# Altium project openadsb_rev_a.PrjPcb
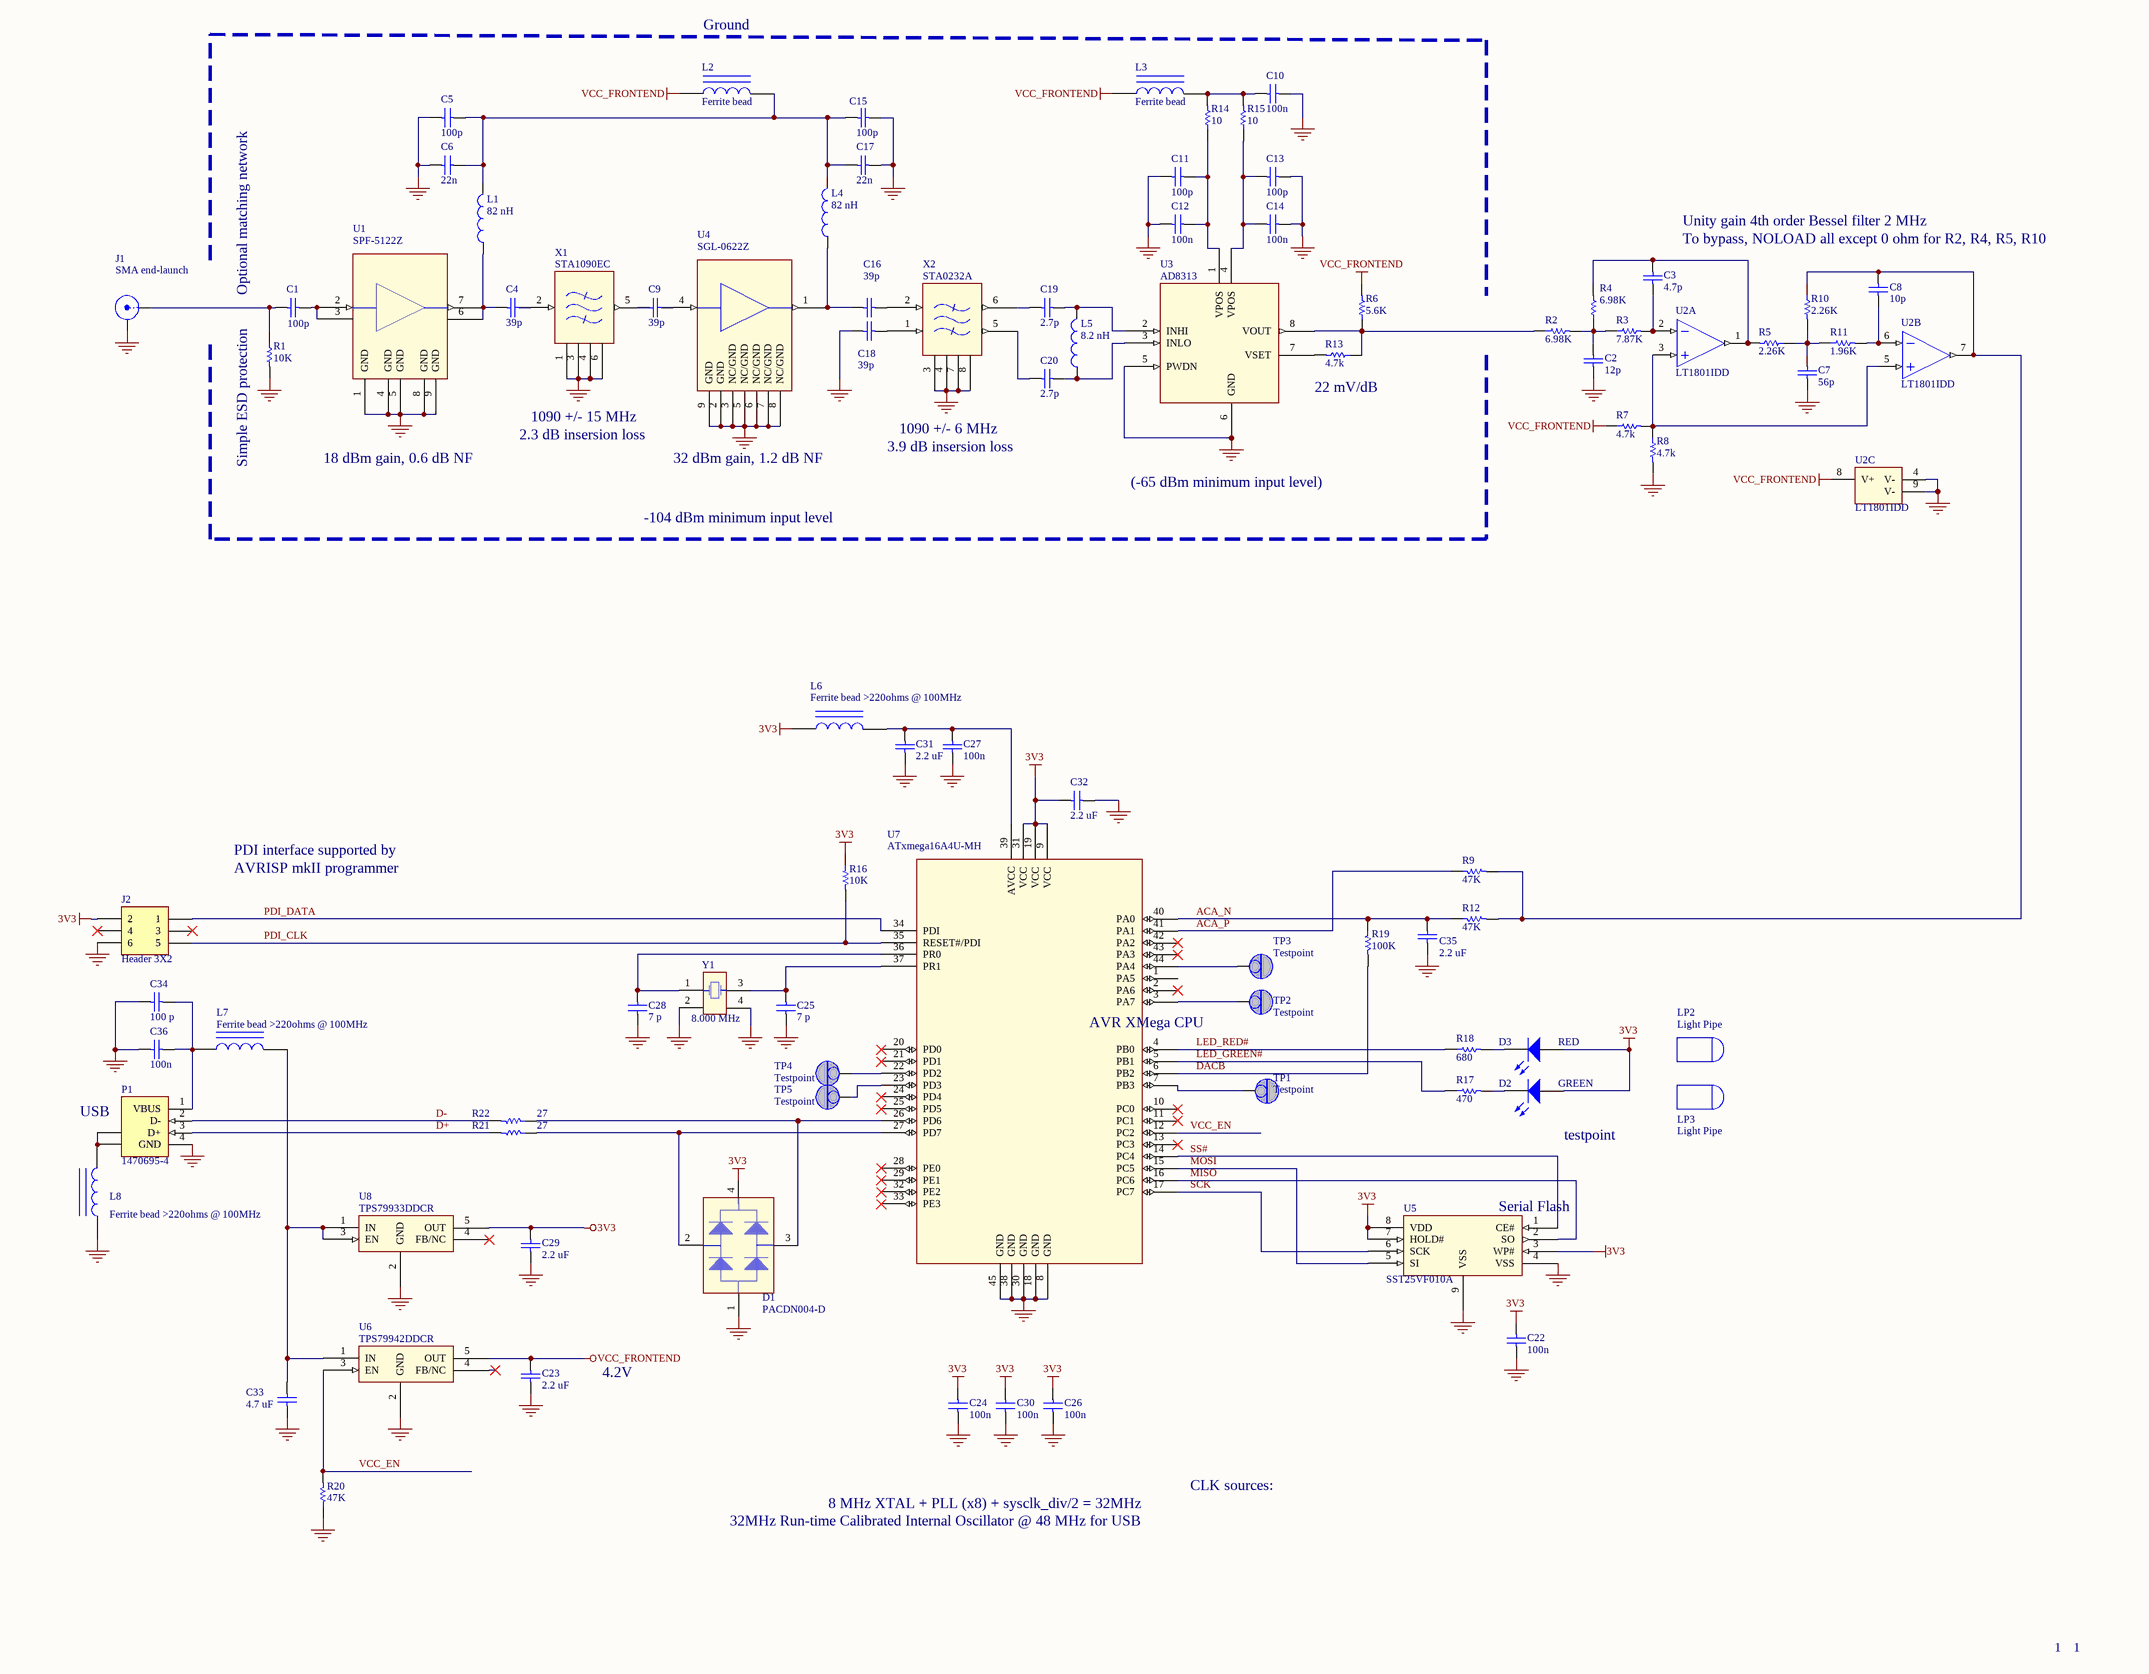
[diagram p0: openadsb_rev_a.SchDoc]
1 sheet, 89 parts. Net scope: global (net labels, ports and power ports of the same name join across sheets).
Board file: openadsb_rev_a.PcbDoc

## Sheet openadsb_rev_a.SchDoc: OpenADSB Receiver and Decoder
size C; Author: B. Kuschak; CompanyName: www.openadsb.com; DrawnBy: B Kuschak; Address1: Sunnyvale, CA USA; Revision: A; SheetNumber: 1; SheetTotal: 1; PageSize: B; Subtitle: ADS-B and Mode A/C on 1090 MHz

### Parts
C1  100p  [0402]
C2  12p  [0402]
C3  4.7p  [0402]
C4  39p  [0402]
C5  100p  [0402]
C6  22n  [0402]
C7  56p  [0402]
C8  10p  [0402]
C9  39p  [0402]
C10  100n  [0402]
C11  100p  [0402]
C12  100n  [0402]
C13  100p  [0402]
C14  100n  [0402]
C15  100p  [0402]
C16  39p  [0402]
C17  22n  [0402]
C18  39p  [0402]
C19  2.7p  [0402]
C20  2.7p  [0402]
C22  100n  [0402]
C23  2.2 uF  [1608[0603]]
C24  100n  [0402]
C25  7 p  [0402]
C26  100n  [0402]
C27  100n  [0402]
C28  7 p  [0402]
C29  2.2 uF  [1608[0603]]
C30  100n  [0402]
C31  2.2 uF  [1608[0603]]
C32  2.2 uF  [1608[0603]]
C33  4.7 uF  [1608[0603]]
C34  100 p  [0402]
C35  2.2 uF  [1608[0603]]
C36  100n  [0402]
D1  PACDN004-D  [SOT-143-RC4_L]
D2  GREEN  [LED0603]
D3  RED  [LED0603]
J1  SMA end-launch  [SMA_ENDLAUNCH]
J2  Header 3X2  [HDR2X3]
L1  82 nH  [0402]
L2  Ferrite bead  [0402]
L3  Ferrite bead  [0402]
L4  82 nH  [0402]
L5  8.2 nH  [0402]
L6  Ferrite bead >220ohms @ 100MHz  [0402]
L7  Ferrite bead >220ohms @ 100MHz  [0402]
L8  Ferrite bead >220ohms @ 100MHz  [0402]
LP2  Light Pipe  [LIGHTPIPE]  (mechanical)
LP3  Light Pipe  (mechanical)
P1  1470695-4  [1470695A]
R1  10K  [0402]
R2  6.98K  [0402]
R3  7.87K  [0402]
R4  6.98K  [0402]
R5  2.26K  [0402]
R6  5.6K  [0402]
R7  4.7k  [0402]
R8  4.7k  [0402]
R9  47K  [0402]
R10  2.26K  [0402]
R11  1.96K  [0402]
R12  47K  [0402]
R13  4.7k  [0402]
R14  10  [0402]
R15  10  [0402]
R16  10K  [0402]
R17  470  [0402]
R18  680  [0402]
R19  100K  [0402]
R20  47K  [0402]
R21  27  [0402]
R22  27  [0402]
TP1  Testpoint  [Testpoint_via]
TP2  Testpoint  [Testpoint_via]
TP3  Testpoint  [Testpoint_via]
TP4  Testpoint  [Testpoint_via]
TP5  Testpoint  [Testpoint_via]
U1  SPF-5122Z  [DFN8_2x2mm]
U2  LT1801IDD  [DFN8_3x3mm]  (parts A,B,C of 3)
U3  AD8313  [MSOP-MS8_N]
U4  SGL-0622Z  [DFN8_2x2mm]
U5  SST25VF010A  [WSON-8]
U6  TPS79942DDCR  [SOT23-5AN]
U7  ATxmega16A4U-MH  [QFN50P700X700-44W3N]
U8  TPS79933DDCR  [SOT23-5AN]
X1  STA1090EC  [STA1090EC]
X2  STA0232A
Y1  8.000 MHz  [ABM3C]

### Nets
3V3: C22.1 C24.1 C26.1 C29.1 C30.1 C32.1 D1.4(V) D2.A D3.A J2.2 L6.2 R16.1 U5.3(WP#) U5.7(HOLD#) U5.8(VDD) U7.9(VCC) U7.19(VCC) U7.31(VCC) U8.5(OUT)
GND: C2.1 C5.2 C6.2 C7.1 C10.2 C11.2 C12.2 C13.1 C14.1 C15.2 C17.2 C18.1 C22.2 C23.2 C24.2 C25.1 C26.2 C27.2 C28.1 C29.2 C30.2 C31.2 C32.2 C33.2 C34.2 C35.2 C36.2 D1.1(GND) J1.2(Y) J2.6 L8.2 P1.4(GND) R1.2 R8.2 R20.1 U1.1(GND) U1.4(GND) U1.5(GND) U1.8(GND) U1.9(GND) U2.4(V-) U2.9(V-) U3.5(PWDN) U3.6(GND) U4.2(GND) U4.3(NC/GND) U4.5(NC/GND) U4.6(NC/GND) U4.7(NC/GND) U4.8(NC/GND) U4.9(GND) U5.4(VSS) U5.9(VSS) U6.2(GND) U7.8(GND) U7.18(GND) U7.30(GND) U7.38(GND) U7.45(GND) U8.2(GND) X1.1(GND) X1.3(GND) X1.4(GND) X1.6(GND) X2.3(GND) X2.4(GND) X2.7(GND) X2.8(GND) Y1.2(GND) Y1.4(OSC1)
VCC_FRONTEND: C23.1 L2.1 L3.1 R6.2 R7.1 U2.8(V+) U6.5(OUT)
ACA_N: C35.1 R12.1 R19.1 U7.40(PA0)
ACA_P: R9.1 U7.41(PA1)
D+: P1.3(D+) R21.2
D-: P1.2(D-) R22.2
DACB: R19.2 U7.6(PB2)
LED_GREEN#: R17.1 U7.5(PB1)
LED_RED#: R18.1 U7.4(PB0)
MISO: U5.2(SO) U7.16(PC6)
MOSI: U5.5(SI) U7.15(PC5)
PDI_CLK: J2.5 R16.2 U7.35(RESET#/PDI)
PDI_DATA: J2.1 U7.34(PDI)
SCK: U5.6(SCK) U7.17(PC7)
SS#: U5.1(CE#) U7.14(PC4)
VCC_EN: R20.2 U6.3(EN) U7.12(PC2)
NetC1_1: C1.1 J1.1(X) R1.1
NetC1_2: C1.2 U1.2(IN) U1.3(NC)
NetC2_2: C2.2 R2.2 R3.1 R4.1
NetC3_1: C3.1 R3.2 U2.2(IN1-)
NetC3_2: C3.2 R4.2 R5.2 U2.1(OUT1)
NetC4_1: C4.1 L1.1 U1.6(NC) U1.7(OUT)
NetC4_2: C4.2 X1.2(IN)
NetC5_1: C5.1 C6.1 C15.1 C17.1 L1.2 L2.2 L4.2
NetC7_2: C7.2 R5.1 R10.2 R11.1
NetC8_1: C8.1 R11.2 U2.6(IN2-)
NetC8_2: C8.2 R9.2 R10.1 R12.2 U2.7(OUT2)
NetC9_1: C9.1 X1.5(OUT)
NetC9_2: C9.2 U4.4(RFIN)
NetC10_1: C10.1 L3.2 R14.2 R15.2
NetC11_1: C11.1 C12.1 R14.1 U3.1(VPOS)
NetC13_2: C13.2 C14.2 R15.1 U3.4(VPOS)
NetC16_1: C16.1 L4.1 U4.1(RFOUT/BIAS)
NetC16_2: C16.2 X2.2(VIN2)
NetC18_2: C18.2 X2.1(VIN1)
NetC19_1: C19.1 X2.6(OUT2)
NetC19_2: C19.2 L5.2 U3.2(INHI)
NetC20_1: C20.1 X2.5(OUT1)
NetC20_2: C20.2 L5.1 U3.3(INLO)
NetC25_2: C25.2 U7.37(PR1) Y1.3(OSC2)
NetC27_1: C27.1 C31.1 L6.1 U7.39(AVCC)
NetC28_2: C28.2 U7.36(PR0) Y1.1(OSC1)
NetC33_1: C33.1 L7.1 U6.1(IN) U8.1(IN) U8.3(EN)
NetC34_1: C34.1 C36.1 L7.2 P1.1(VBUS)
NetD1_2: D1.2(CH1) R21.1 U7.27(PD7)
NetD1_3: D1.3(CH1) R22.1 U7.26(PD6)
NetD2_K: D2.K R17.2
NetD3_K: D3.K R18.2
NetL8_1: L8.1 P1.5(SHLD) P1.6(SHLD)
NetR2_1: R2.1 R6.1 R13.1 U3.8(VOUT)
NetR7_2: R7.2 R8.1 U2.3(IN1+) U2.5(IN2+)
NetR13_2: R13.2 U3.7(VSET)
NetTP1_1: TP1.1 U7.7(PB3)
NetTP2_1: TP2.1 U7.3(PA7)
NetTP3_1: TP3.1 U7.44(PA4)
NetTP4_1: TP4.1 U7.22(PD2)
NetTP5_1: TP5.1 U7.23(PD3)

Not connected (* = marked no-connect by the designer): J2 3* 4*; U6 4(FB/NC)*; U7 1(PA5) 2(PA6)* 10(PC0)* 11(PC1)* 13(PC3)* 20(PD0)* 21(PD1)* 24(PD4)* 25(PD5)* 28(PE0)* 29(PE1)* 32(PE2)* 33(PE3)* 42(PA2)* 43(PA3)*; U8 4(FB/NC)*

### Notes on the sheet
- Ground
- Unity gain 4th order Bessel filter 2 MHz
- Optional matching network
- To bypass, NOLOAD all except 0 ohm for R2, R4, R5, R10
- 1090 +/- 15 MHz
- 22 mV/dB
- (near R1) Simple ESD protection
- 18 dBm gain, 0.6 dB NF
- (near U4) 2.3 dB insersion loss
- 32 dBm gain, 1.2 dB NF
- 3.9 dB insersion loss
- 1090 +/- 6 MHz
- -104 dBm minimum input level
- (-65 dBm minimum input level)
- PDI interface supported by
- (near J2) AVRISP mkII programmer
- (near U7) AVR XMega CPU
- USB
- testpoint
- (near U5) Serial Flash
- 4.2V
- CLK sources:
- 32MHz Run-time Calibrated Internal Oscillator @ 48 MHz for USB
- 8 MHz XTAL + PLL (x8) + sysclk_div/2 = 32MHz
- 1

### Library data of the parts
C1-C20 C22-C36 = Cap: Capacitor; Value: 100pF; Published: 8-Jun-2000; LatestRevisionDate: 17-Jul-2002; LatestRevisionNote: Re-released for DXP Platform.; PackageReference: RAD-0.3; Publisher: Altium Limited; PackageDescription: Radial Cap, Thru-Hole; 2 Leads; 0.3 in Pin Spacing
D1 = PACDN004: ESD protection; Manufacturer: On Semi; PartNumber: PACDN004-D
D2 D3 = LED3: Typical BLUE SiC LED; Published: 8-Jun-2000; LatestRevisionDate: 17-Dec-2003; LatestRevisionNote: PCB Footprint replaced.; DatasheetVersion: 16-Apr-2002; PackageVersion: 16-Apr-2002; PackageReference: 3.5X2.8X1.9; Publisher: Altium Limited; PackageDescription: SM LED; 2 C-Bend Leads; Body 3.5 x 2.8 x 1.9 mm, inc leads (LxWxH typ)
J1 = SMB: SMB Straight Connector; LatestRevisionDate: 17-Jul-2002; LatestRevisionNote: Re-released for DXP Platform.; Publisher: Altium Limited
J2 = Header 3X2: Header, 3-Pin, Dual row; LatestRevisionDate: 17-Jul-2002; LatestRevisionNote: Re-released for DXP Platform.; Publisher: Altium Limited
L1 = Inductor: PartNumber: TKS2388CT; Manufacturer: TOKO; Code_IEC: 1005; Published: 8-Jun-2000; LatestRevisionDate: 29-May-2009; LatestRevisionNote: IPC-7351 Footprint Added.; PackageReference: 0402-A; Publisher: Altium Limited; PackageDescription: Chip Inductor; Code_JEITA: 0402
L2 L3 L6-L8 = Inductor Iron: Magnetic-Core Inductor; Published: 24-Mar-1999; LatestRevisionDate: 17-Jul-2002; LatestRevisionNote: Re-released for DXP Platform.; PackageReference: AXIAL-0.9; Publisher: Altium Limited; PackageDescription: Axial Device, Thru-Hole; 2 Leads; 0.9 in Pin Spacing
L4 L5 = Inductor: Code_IEC: 1005; Published: 8-Jun-2000; LatestRevisionDate: 29-May-2009; LatestRevisionNote: IPC-7351 Footprint Added.; PackageReference: 0402-A; Publisher: Altium Limited; PackageDescription: Chip Inductor; Code_JEITA: 0402
LP2 LP3 = LIGHT_PIPE: PartNumber: PLP2-215; Manufacturer: Bivar
P1 = 1470695-4: USB 1.1, Right Angle, SMT, A Type, Plug, 4 Position, Black; ContactMaterial: Brass; ContactPlating: Gold (30) over Nickel (50); PCB_Layout: Complies with manufacturer's recommendation.; DrillSize: Corresponds to nominal value.; PanelGround: Without; Published: 15-Jul-2004; DatasheetDocument: 21-Jan-2003; PackageDocument: 21-Jan-2003; PackageReference: 1470695A; Publisher: Altium Limited; HousingMaterial: Thermoplastic; ComponentLink1Description: Manufacturer Link; ComponentLink1URL: http://www.tycoelectronics.com/; ComponentLink2Description: Packaging Specification; ComponentLink2URL: http://ecommas.tycoelectronics.com/commerce/DocumentDelivery/DDEController?Action=showdoc&DocId=Customer+Drawing%7F1470695%7FO%7Fpdf%7FEnglish%7FC_1470695_O.pdf
R1-R22 = Res1: Resistor; Value: 1K; Published: 8-Jun-2000; LatestRevisionDate: 17-Jul-2002; LatestRevisionNote: Re-released for DXP Platform.; PackageReference: AXIAL-0.3; Publisher: Altium Limited; PackageDescription: Axial Device, Thru-Hole; 2 Leads; 0.3 in Pin Spacing
U1 = LNA1: Manufacturer: Sirenza; PartNumber: SPF-5122Z
U2 = LT1801: Manufacturer: Linear Tech; PartNumber: LT1801IDD
U3 = AD8313: AD8313 Logarithmic Amp
U4 = SGL0622Z: Manufacturer: RFMD; PartNumber: SGL-0622Z
U5 = SERFLASH: Manufacturer: SST; PartNumber: SST25VF010A
U6 U8 = TPS799XX: Manufacturer: Texas Instruments
  U6: PartNumber: TPS79942DDCR
  U8: PartNumber: TPS79933DDCR
U7 = ATXMEGA164AU: Manufacturer: Atmel; PartNumber: ATxmega16A4U-MH; Distributor: Arrow
X1 = BP_FILTER_UNBAL: PartNumber: STA1090EC
X2 = BP_FILTER_BAL2: PartNumber: STA0232A
Y1 = XTAL_4: Manufacturer: Abracon; PartNumber: ABM3B-8.000MHZ-B2-T